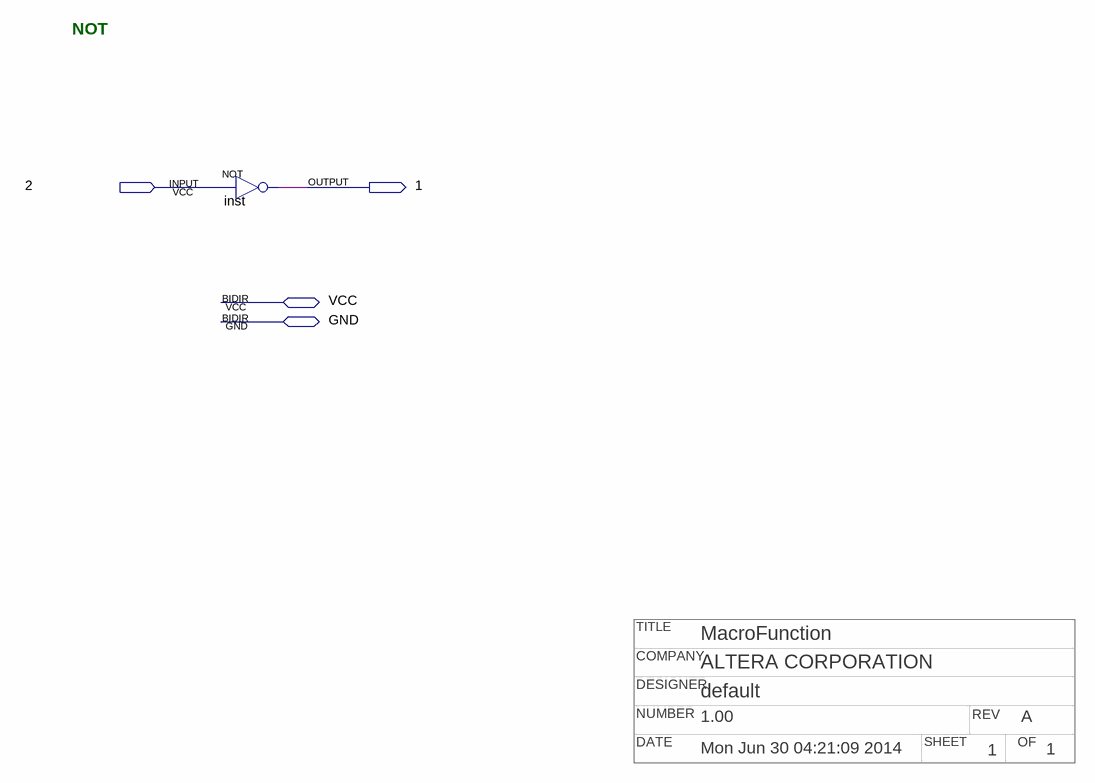
[diagram p0: schematic sheet]
// Quartus schematic npnot.bdf as structural Verilog: 1 symbols, 4 pins
// Title block: TITLE: MacroFunction; COMPANY: ALTERA CORPORATION; DESIGNER: default; NUMBER: 1.00; REV: A; DATE: Mon Jun 30 04:21:09 2014; SHEET: 1; OF: 1
module npnot (
  input  \2 ,
  inout  VCC,
  inout  GND,
  output \1 
);

  not inst (\1 , \2 );

  // Notes on the sheet:
  //   NOT
endmodule
